# EAGLE design jdds-arduino (EAGLE 7.4.0)
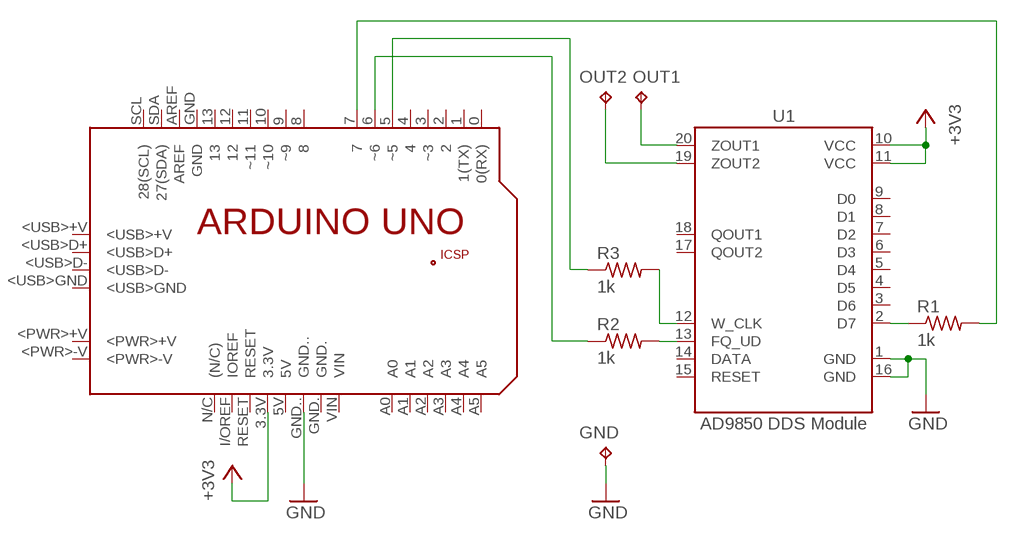
[diagram p0: schematic, sheet 1]

## Parts
GND  TPPAD1-20  [P1-20]
OUT1  TPPAD1-20  [P1-20]
OUT2  TPPAD1-20  [P1-20]
PCB1  ARDUINO_UNO  [ARDUINO_UNO]
R1  1k  R-US_0207/10  [0207/10]
R2  1k  R-US_0207/10  [0207/10]
R3  1k  R-US_0207/10  [0207/10]
U1  AD9850 DDS Module  DDS_MODULE:AD9850DDS_MODULE  [DDS_AD9850]

## Nets
+3V3: PCB1.3.3V U1.10(VCC) U1.11(VCC)
GND: GND.TP PCB1.GND.. U1.1(GND) U1.16(GND)
N$1: OUT1.TP U1.20(ZOUT1)
N$2: OUT2.TP U1.19(ZOUT2)
N$3: R1.1 U1.2(D7)
N$4: R2.2 U1.13(FQ_UD)
N$5: R3.2 U1.12(W_CLK)
N$6: PCB1.7 R1.2
N$7: PCB1.5(~5) R3.1
N$8: PCB1.6(~6) R2.1
Unconnected: PCB1.0(0(RX)) PCB1.1(1(TX)) PCB1.2 PCB1.3(~3) PCB1.4 PCB1.5V PCB1.8 PCB1.9(~9) PCB1.10(~10) PCB1.11(~11) PCB1.12 PCB1.13 PCB1.+5V PCB1.<PWR>+V PCB1.<PWR>-V PCB1.<USB>+V PCB1.<USB>D+ PCB1.<USB>D- PCB1.<USB>GND PCB1.A0 PCB1.A1 PCB1.A2 PCB1.A3 PCB1.A4 PCB1.A5 PCB1.AREF PCB1.GND PCB1.GND. PCB1.GND_ PCB1.I/OREF(IOREF) PCB1.MISO PCB1.MOSI PCB1.N/C((N/C)) PCB1.RESET PCB1.RESET. PCB1.SCK PCB1.SCL(28(SCL)) PCB1.SDA(27(SDA)) PCB1.VIN U1.3(D6) U1.4(D5) U1.5(D4) U1.6(D3) U1.7(D2) U1.8(D1) U1.9(D0) U1.14(DATA) U1.15(RESET) U1.17(QOUT2) U1.18(QOUT1)

## Library data of the parts
GND OUT1 OUT2 = testpad:TP: Test pad
PCB1 = E14_Arduino_revB:ARDUINO_UNO: Device for representing an Arduino Uno board with a footprint in an EAGLE design. Created by Dave Young for Element14. More EAGLE documentation at: http://www.element14.com/community/community/knode/cadsoft_eagle
R1-R3 = resistor:R-US_: RESISTOR, American symbol
U1 = dds-module-ad9850:DDS_MODULE:AD9850: AD9850 DDS Module Created by Johan Adler, October 2014. Not tested on an actual PCB, so I can't promise anything. Also please check the actual pinout of your specific module. Mine are of the low price eBay version, and the pinout is correct for my modules. The placement of VCC over data pins over GND on the symbol is meant to make it easier to set it up for default serial transfer. For this you would connect D0 and D1 to VCC, D2 to GND. IOUT is analog signal out, sinus wave, QOUT is square wave. Outputs 1 are normal, outputs 2 are inverted.

## Board
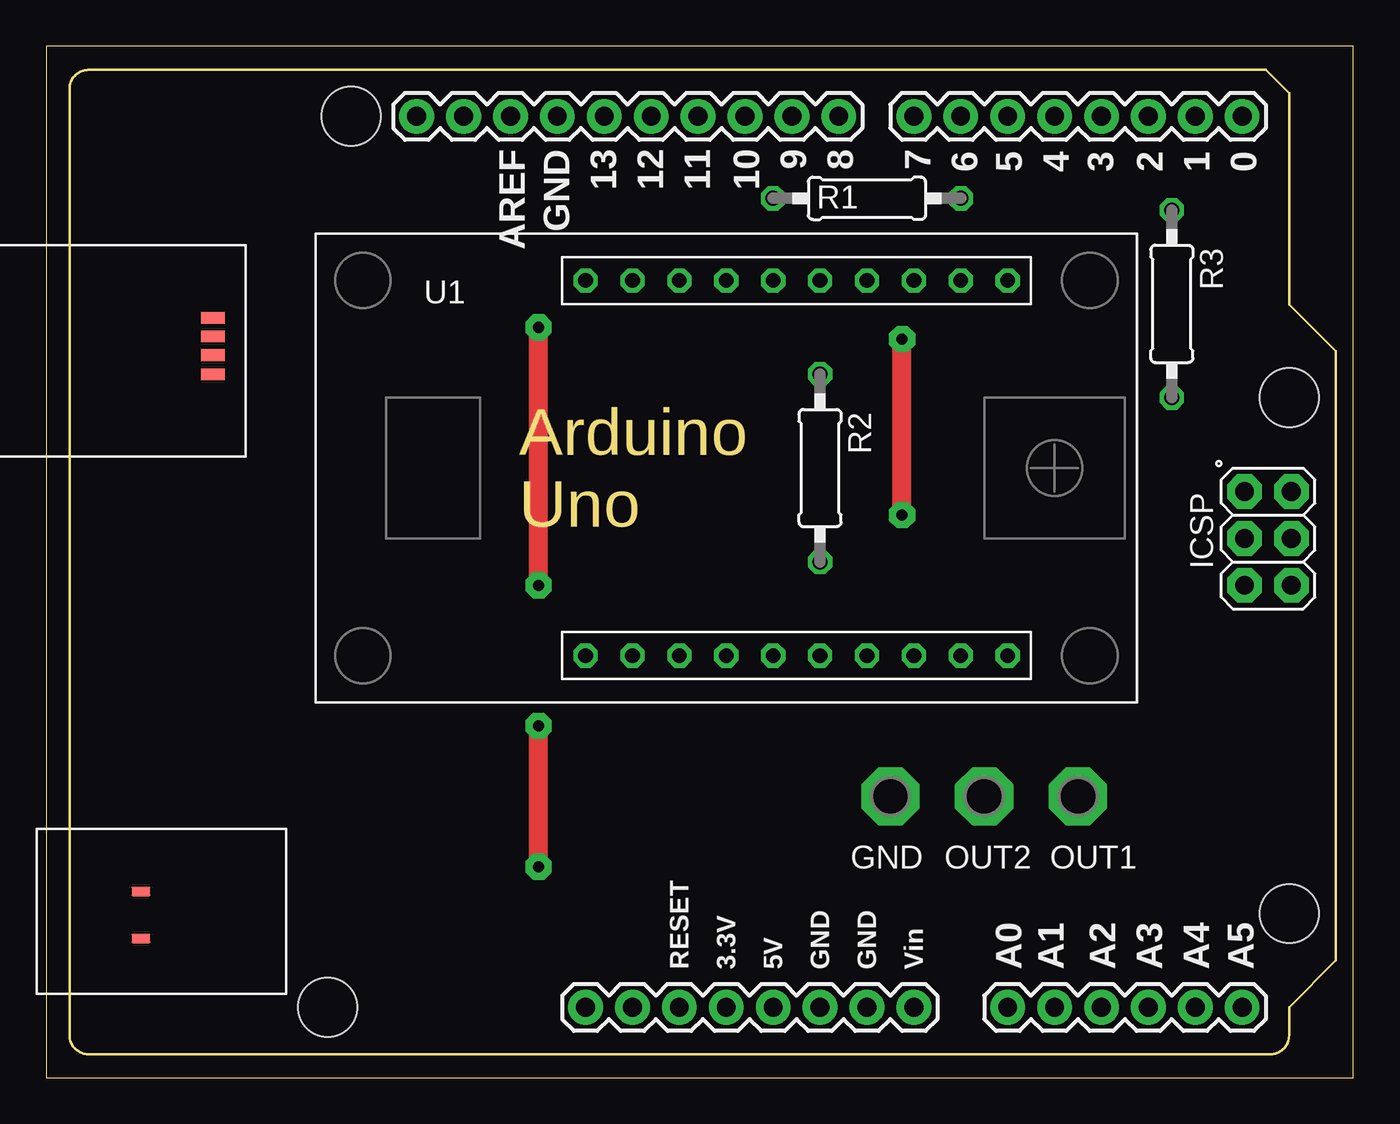
[diagram p1: board, top side]
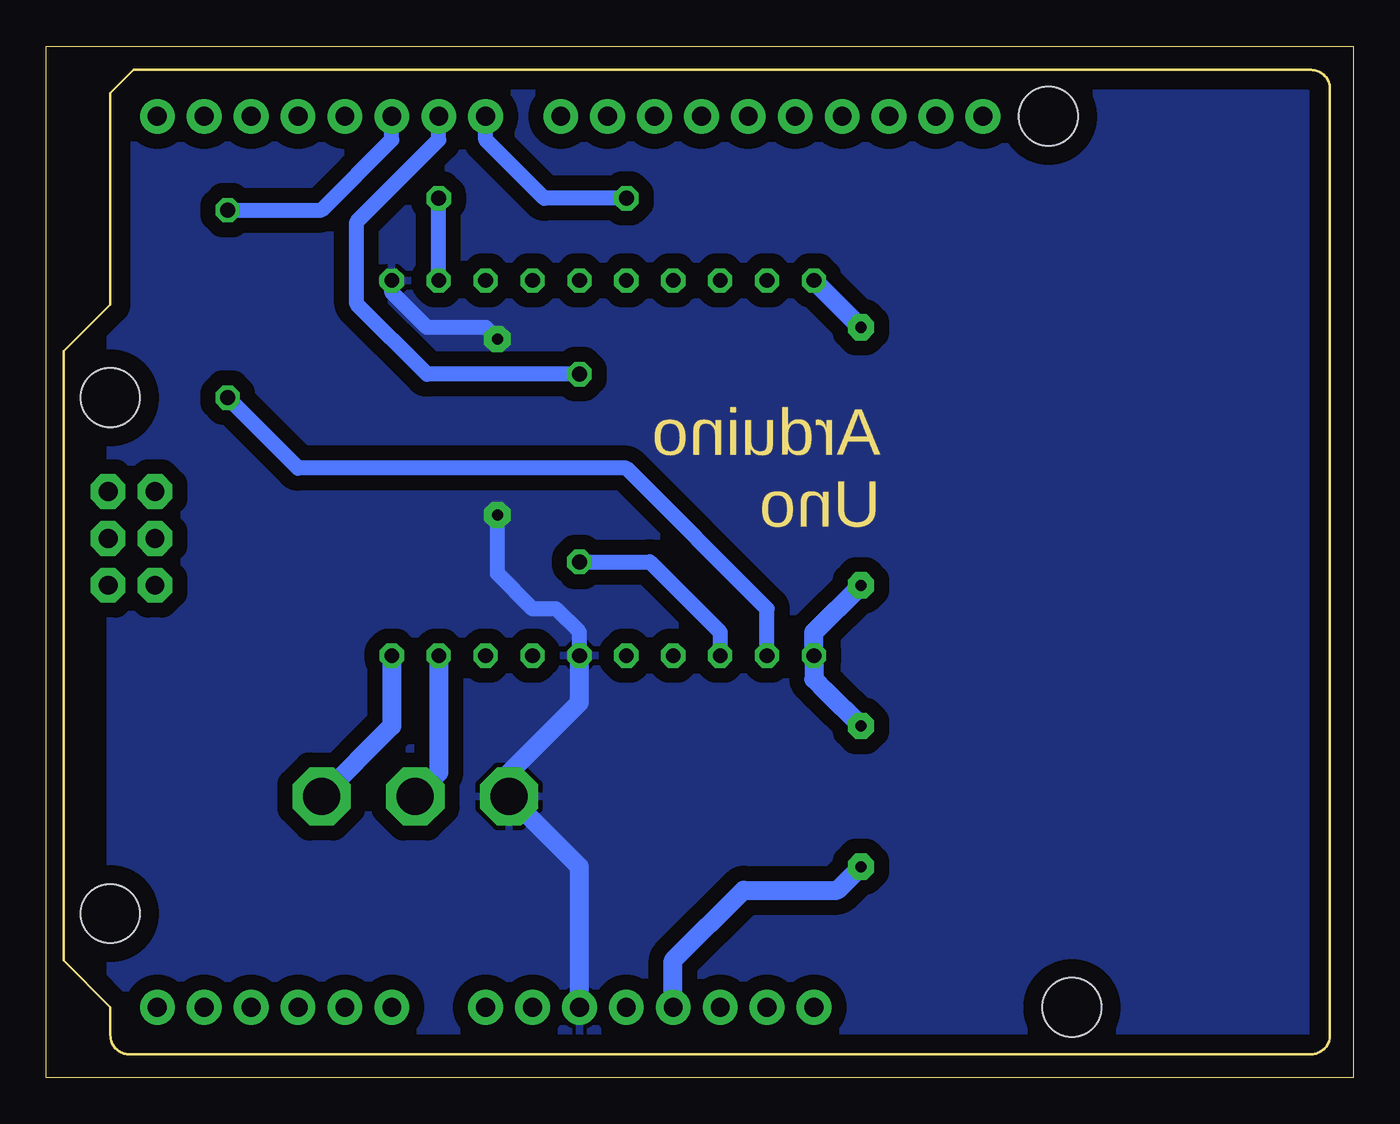
[diagram p2: board, bottom side, seen from below]

Size 70.79 x 55.87 mm. Coordinates in mm from the lower left corner, seen from the top.
Outline: 0,0 70.79,0 70.79,55.87 0,55.87 0,0
Copper layers (1*16): Top 0.035mm / dielectric 1.5mm / Bottom 0.035mm
Design rules "default": minimum track width 10mil, minimum drill 24mil, track to track 8mil, track to pad 8mil, pad to pad 8mil, via to via 8mil, smd to smd 8mil, copper to edge 40mil, drill to drill 8mil, minimum pad ring 10mil, minimum via ring 8mil, stop-mask expansion 4mil, vias tented up to drill 0mil, thermal gap 10mil

### Footprints (pad centres in the part's own frame; a part is rotated, then mirrored left to right if it is on the bottom)
P1-20 = drill 2.007 pad 3.15 octagon: TP 0,0
ARDUINO_UNO = drill 1.016 pad 1.88: 0 63.5,50.8; 1 60.96,50.8; 2 58.42,50.8; 3 55.88,50.8; 3.3V 35.56,2.54; 4 53.34,50.8; 5 50.8,50.8; 5V 38.1,2.54; 6 48.26,50.8; 7 45.72,50.8; 8 41.656,50.8; 9 39.116,50.8; 10 36.576,50.8; 11 34.036,50.8; 12 31.496,50.8; 13 28.956,50.8; A0 50.8,2.54; A1 53.34,2.54; A2 55.88,2.54; A3 58.42,2.54; A4 60.96,2.54; A5 63.5,2.54; AREF 23.876,50.8; GND 26.416,50.8; GND. 43.18,2.54; GND.. 40.64,2.54; I/OREF 30.48,2.54; N/C 27.94,2.54; RESET 33.02,2.54; SCL 18.796,50.8; SDA 21.336,50.8; VIN 45.72,2.54 | drill 1.016 pad 1.88 octagon: +5V 66.167,30.48; GND_ 66.167,25.4; MISO 63.627,30.48; MOSI 66.167,27.94; RESET. 63.627,25.4; SCK 63.627,27.94 | smd 1.016 x 0.508: <PWR>+V 3.861,8.814; <PWR>-V 3.861,6.274 | smd 1.27 x 0.635: <USB>+V 7.772,39.878; <USB>D+ 7.772,38.887; <USB>D- 7.772,37.871; <USB>GND 7.772,36.83 | hole 3.2: 66.04,7.62; 66.04,35.56; 15.24,50.8; 13.97,2.54
0207/10 = drill 0.813 octagon: 1 -5.08,0; 2 5.08,0
DDS_AD9850 = drill 0.8 octagon: 1 -15.24,-10.16; 2 -12.7,-10.16; 3 -10.16,-10.16; 4 -7.62,-10.16; 5 -5.08,-10.16; 6 -2.54,-10.16; 7 0,-10.16; 8 2.54,-10.16; 9 5.08,-10.16; 10 7.62,-10.16; 11 7.62,10.16; 12 5.08,10.16; 13 2.54,10.16; 14 0,10.16; 15 -2.54,10.16; 16 -5.08,10.16; 17 -7.62,10.16; 18 -10.16,10.16; 19 -12.7,10.16; 20 -15.24,10.16

### Placement (x,y rotation side)
GND  45.72,15.24 0 top
OUT1  55.88,15.24 0 top
OUT2  50.8,15.24 0 top
PCB1  1.27,1.27 0 top
R1  44.45,47.62 180 top
R2  41.91,33.02 270 top
R3  60.96,41.91 270 top
U1  36.83,33.02 180 top

### Tracks (layer width: path | path; a pad name or v marks a point on that pad's centre or on a via)
+3V3  (via drill 0.6 pad 1.42)
  Top 1.016: v26.67,26.67 v26.67,40.64 | v26.67,11.43 v26.67,19.05
  Bottom 1.016: PCB1.3.3V 36.83,6.35 33.02,10.16 27.94,10.16 v26.67,11.43 | v26.67,26.67 29.21,24.13 U1.11 29.21,21.59 28.57,20.95 v26.67,19.05 | v26.67,40.64 U1.10
GND  (via drill 0.6 pad 1.42)
  Top 1.016: v46.35,30.48 v46.35,40.01
  Bottom 0.813: U1.16 41.91,24.13 43.18,25.4 44.45,25.4 46.35,27.3 v46.35,30.48 | v46.35,40.01 46.99,40.64 50.16,40.64 52.07,42.55 U1.1
  Bottom 1.016: U1.16 41.91,20.32 45.72,16.51 GND.TP 41.91,11.43 PCB1.GND..
  pour Bottom (isolate 0.813): 2.54,54.61 67.31,54.61 67.31,1.27 1.27,1.27 1.27,54.61
N$1
  Bottom 1.016: U1.20 52.07,19.05 OUT1.TP
N$2
  Bottom 1.016: U1.19 49.53,16.51 OUT2.TP
N$3
  Bottom 0.813: U1.2 R1.1
N$4
  Bottom 0.813: R2.2 38.1,27.94 34.29,24.13 U1.13
N$5
  Bottom 0.813: U1.12 31.75,25.4 39.37,33.02 57.15,33.02 R3.2
N$6
  Bottom 0.813: R1.2 43.81,47.62 46.99,50.8 PCB1.7
N$7
  Bottom 0.813: R3.1 55.88,46.99 52.07,50.8 PCB1.5
N$8
  Bottom 0.813: R2.1 50.16,38.1 53.98,41.91 53.98,46.35 49.53,50.8 PCB1.6